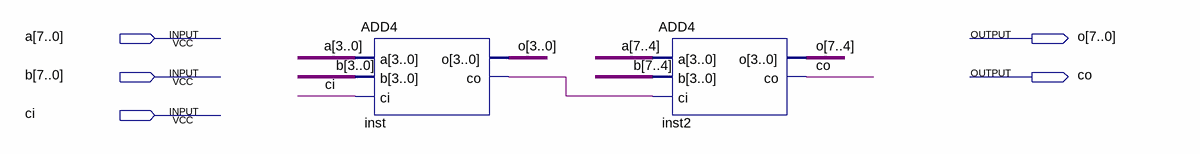
[diagram p0: schematic sheet]
// Quartus schematic ADD8.bdf as structural Verilog: 2 symbols, 5 pins
module ADD8 (
  input  [7:0] a,
  input  [7:0] b,
  input  ci,
  output [7:0] o,
  output co
);

  wire inst_co;

  ADD4 inst (.a(a[3:0]), .b(b[3:0]), .ci(ci), .o(o[3:0]), .co(inst_co));
  ADD4 inst2 (.a(a[7:4]), .b(b[7:4]), .ci(inst_co), .o(o[7:4]), .co(co));
endmodule
